# EAGLE design power-slot (EAGLE 9.4.2)
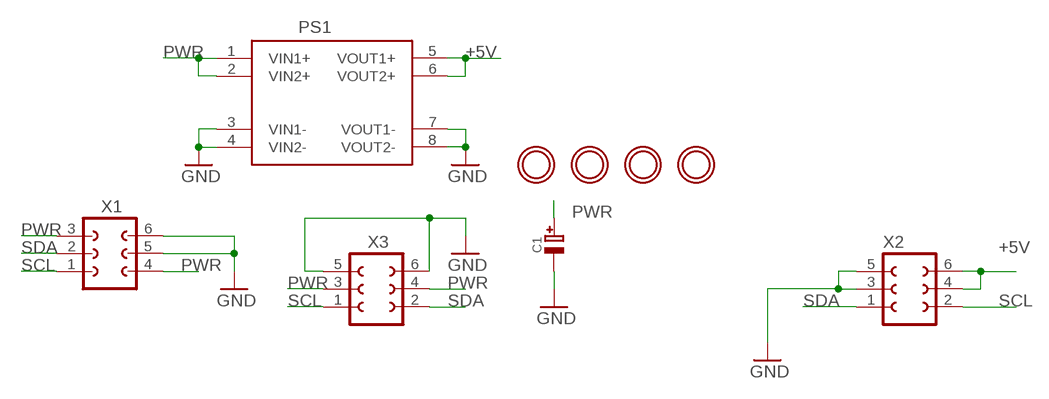
[diagram p0: schematic, sheet 1]

## Parts
C1  CAP_ELECTROLYTICPTH_3.5MMGRID_8MMDIA  [CELEC_3.5MM_8MM]
PS1  K8801MODULE  [K8801]
U$1  MOUNTINGHOLE2.5_THICK  [MOUNTINGHOLE_2.5_PLATED_THICK]
U$2  MOUNTINGHOLE2.5_THICK  [MOUNTINGHOLE_2.5_PLATED_THICK]
U$3  MOUNTINGHOLE2.5_THICK  [MOUNTINGHOLE_2.5_PLATED_THICK]
U$4  MOUNTINGHOLE2.5_THICK  [MOUNTINGHOLE_2.5_PLATED_THICK]
X1  CON-MA03-2MA03-2W  [MA03-2W]
X2  CON-FE03-2CARDEDGE-0.1  [FE3-2-CARDEDGE-0.1]
X3  FE06-2W  [FE06-2W]

## Nets
+5V: PS1.5(VOUT1+) PS1.6(VOUT2+) X2.4 X2.6
GND: C1.- PS1.3(VIN1-) PS1.4(VIN2-) PS1.7(VOUT1-) PS1.8(VOUT2-) X1.5 X1.6 X2.3 X2.5 X3.5 X3.6
PWR: C1.+ PS1.1(VIN1+) PS1.2(VIN2+) X1.3 X1.4 X3.3 X3.4
SCL: X1.1 X2.2 X3.1
SDA: X1.2 X2.1 X3.2

## Library data of the parts
C1 = sanisimov:CAP_ELECTROLYTIC: Electrolytic Capacitors SMT PANASONIC_C - Size C Panasonic Electrolytic Aluminum Capacitor 47µF 16V 20% Electrolytic Capacitor [Digikey: PCE3890TR-ND] PANASONIC_D - Size D Panasonic Electrolytic Aluminum Capacitor 100µF 25V 20% Electrolytic Capacitor [Digikey: PCE3898TR-ND] PTH 3.5 mm grid, 8 mm diameter ... 3.5 mm grid, 10 mm diameter ...
PS1 = sanisimov:K8801: 7V-28V to 5V DC-DC Step Down Power Supply Module Voltage Buck Converter 3A Power Supply Board Input voltage:DC 7V-28V Output valtage:DC 5V Output current:3A. max(2A for long time) Working frequency:570KHz Size:22*17.8*5mm
U$1-U$4 = sanisimov:MOUNTINGHOLE: Mounting Hole For #2 screws (0.086"/2.18mm width, 0.094"/2.4mm hole) use 2.5mm; BOM: EXCLUDE
X1 = sanisimov:CON-MA03-2
X2 = sanisimov:CON-FE03-2: FEMALE HEADER
X3 = sanisimov:FE06-2W: FEMALE HEADER; OC_FARNELL: unknown; OC_NEWARK: unknown

## Board
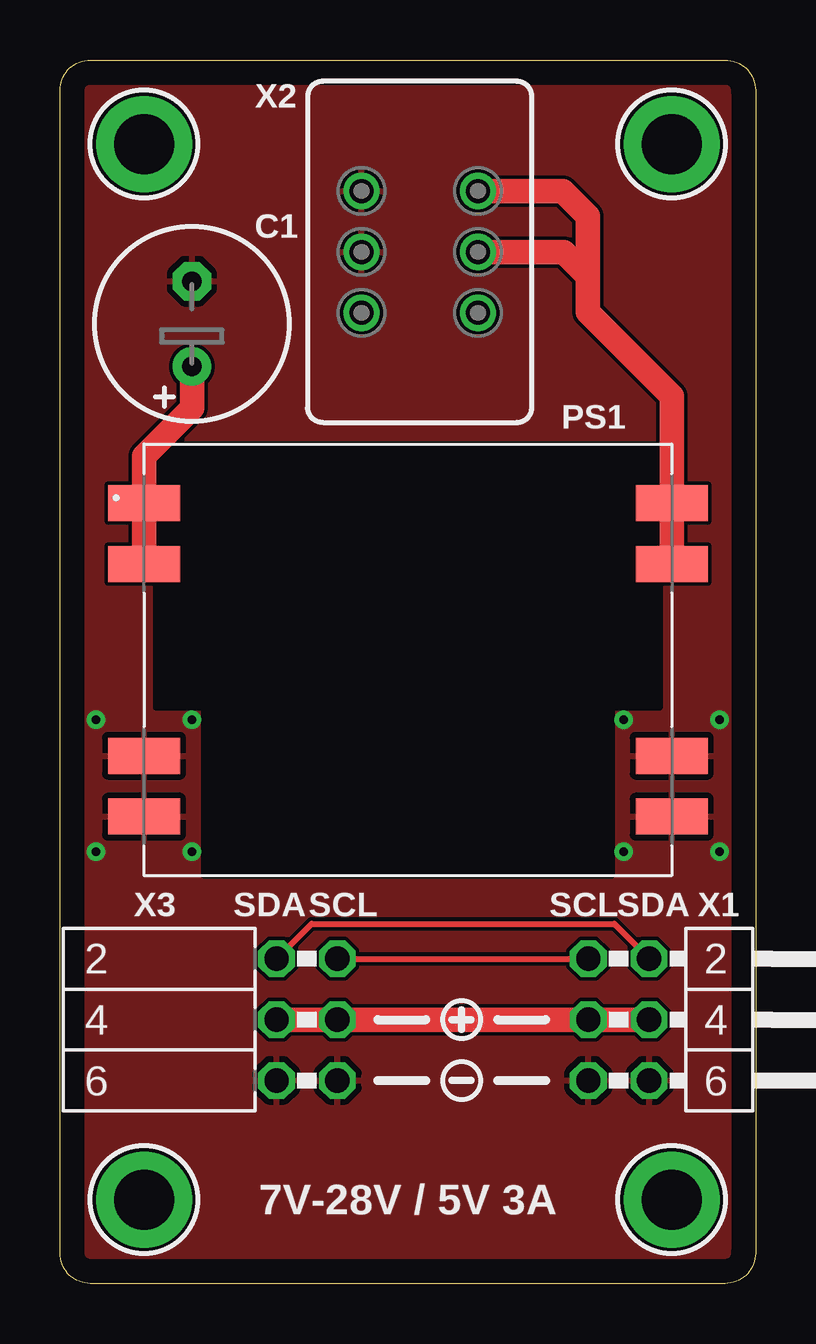
[diagram p1: board, top side]
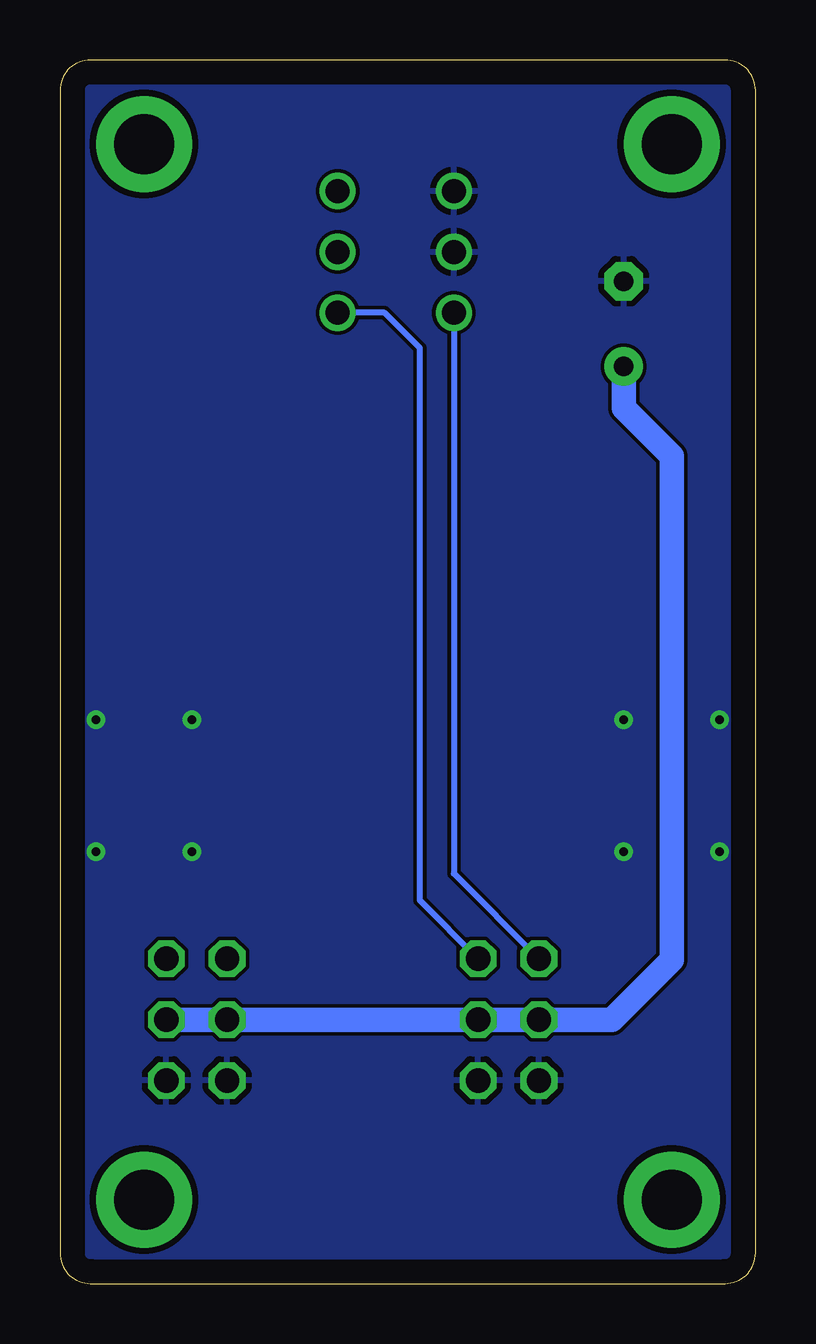
[diagram p2: board, bottom side, seen from below]

Size 29 x 51 mm. Coordinates in mm from the lower left corner, seen from the top.
Outline: 27.73,0 1.27,0 arc-90 0,1.27 0,49.73 arc-90 1.27,51 27.73,51 arc-90 29,49.73 29,1.27 arc-90 27.73,0
Copper layers (1*16): Top 0.035mm / dielectric 1.5mm / Bottom 0.035mm
Design rules "default *": minimum track width 6mil, minimum drill 0.35mm, track to track 6mil, track to pad 6mil, pad to pad 6mil, via to via 6mil, smd to smd 6mil, copper to edge 40mil, drill to drill 6mil, minimum pad ring 10mil, minimum via ring 8mil, stop-mask expansion 4mil, vias tented up to drill 15mil, thermal gap 10mil

### Footprints (pad centres in the part's own frame; a part is rotated, then mirrored left to right if it is on the bottom)
CELEC_3.5MM_8MM = drill 0.813 pad 1.6: + -1.778,0 | drill 0.813 pad 1.6 octagon: - 1.778,0
K8801 = smd 1.5 x 3: 1 -6.54,-11; 2 -4,-11; 3 4,-11; 4 6.54,-11; 5 -6.54,11; 6 -4,11; 7 4,11; 8 6.54,11
MOUNTINGHOLE_2.5_PLATED_THICK = drill 2.5 pad 4: P$1 0,0
MA03-2W = drill 1.016 octagon: 1 -2.54,-1.27; 2 -2.54,1.27; 3 0,-1.27; 4 0,1.27; 5 2.54,-1.27; 6 2.54,1.27
FE3-2-CARDEDGE-0.1 = drill 1: 1 -2.54,2.426; 2 -2.54,-2.426; 3 0,2.426; 4 0,-2.426; 5 2.54,2.426; 6 2.54,-2.426
FE06-2W = drill 1.016 octagon: 1 -2.54,1.27; 2 -2.54,-1.27; 3 0,1.27; 4 0,-1.27; 5 2.54,1.27; 6 2.54,-1.27

### Placement (x,y rotation side)
C1  5.5,40 90 top
PS1  14.5,26 270 top
U$1  3.5,47.5 0 top
U$2  25.5,47.5 0 top
U$3  25.5,3.5 0 top
U$4  3.5,3.5 0 top
U$5  [SYMBOL_PLUS]  16.75,11 180 top
U$6  [SYMBOL_MINUS]  16.75,8.46 180 top
X1  23.3,11 270 top
X2  15,43 90 top
X3  10.3,11 270 top

### Tracks (layer width: path | path; a pad name or v marks a point on that pad's centre or on a via)
+5V
  Top 1.016: PS1.6 PS1.5 25.5,37 22,40.5 22,42 | X2.6 20.96,45.54 22,44.5 22,42 | X2.4 21,43 22,42
GND  (via drill 0.35)
  other vias: 1.5,23.5 1.5,18 5.5,18 5.5,23.5 23.5,23.5 27.5,23.5 23.5,18 27.5,18
  pour Top: -1,52 30,52 30,-1 -1,-1
  pour Bottom: -1,52 30,52 30,-1 -1,-1
  cutout Top: 4,35 25,35 25,24 23,24 23,17 6,17 6,24 4,24
PWR
  Top 1.016: C1.+ 5.5,36.5 3.5,34.5 PS1.1 PS1.2 | X3.4 X3.3 X1.3 X1.4
  Bottom 1.016: C1.+ 5.5,36.5 3.5,34.5 3.5,13.5 6,11 X3.4 X3.3 X1.3 X1.4
SCL
  Top 0.254: X3.1 X1.1
  Bottom 0.254: X3.1 14,15.97 14,39 15.46,40.46 X2.2
SDA
  Top 0.254: X3.2 10.49,15 23.11,15 X1.2
  Bottom 0.254: X3.2 12.57,17.08 X2.1

### Text on the board
tPlace: SDA | SCL | SCL | SDA
tNames: 7V-28V / 5V 3A